# Altium schematic sheet Gate MUX.SchDoc
size 406 x 304 mm; SheetNumber: 7; SheetTotal: 18
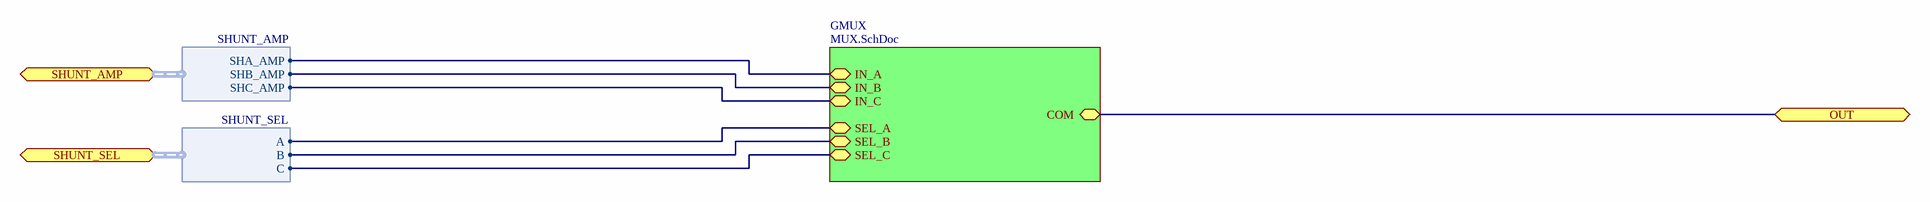
[diagram p0: Gate MUX.SchDoc]

## Sub-sheets
GMUX = MUX.SchDoc: COM (bidir), IN_A (bidir), IN_B (bidir), IN_C (bidir), SEL_A (bidir), SEL_B (bidir), SEL_C (bidir)

## Ports
OUT (bidir), SHUNT_AMP (bidir, harness SHUNT_AMP), SHUNT_SEL (bidir, harness SHUNT_SEL)

## Harnesses
SHUNT_SEL: A, B, C
SHUNT_AMP: SHA_AMP, SHB_AMP, SHC_AMP

## Nets
OUT: port OUT, sheet GMUX/COM
(unnamed): sheet GMUX/IN_A, port SHUNT_AMP.SHA_AMP
(unnamed): sheet GMUX/IN_B, port SHUNT_AMP.SHB_AMP
(unnamed): sheet GMUX/IN_C, port SHUNT_AMP.SHC_AMP
(unnamed): sheet GMUX/SEL_A, port SHUNT_SEL.A
(unnamed): sheet GMUX/SEL_B, port SHUNT_SEL.B
(unnamed): sheet GMUX/SEL_C, port SHUNT_SEL.C

## Notes on the sheet
- Rev
- Sheet Name:
- Date:
- Sheet
- Designer:
- of